# EAGLE design TRHCO2_datalogger (EAGLE 8.2.1)
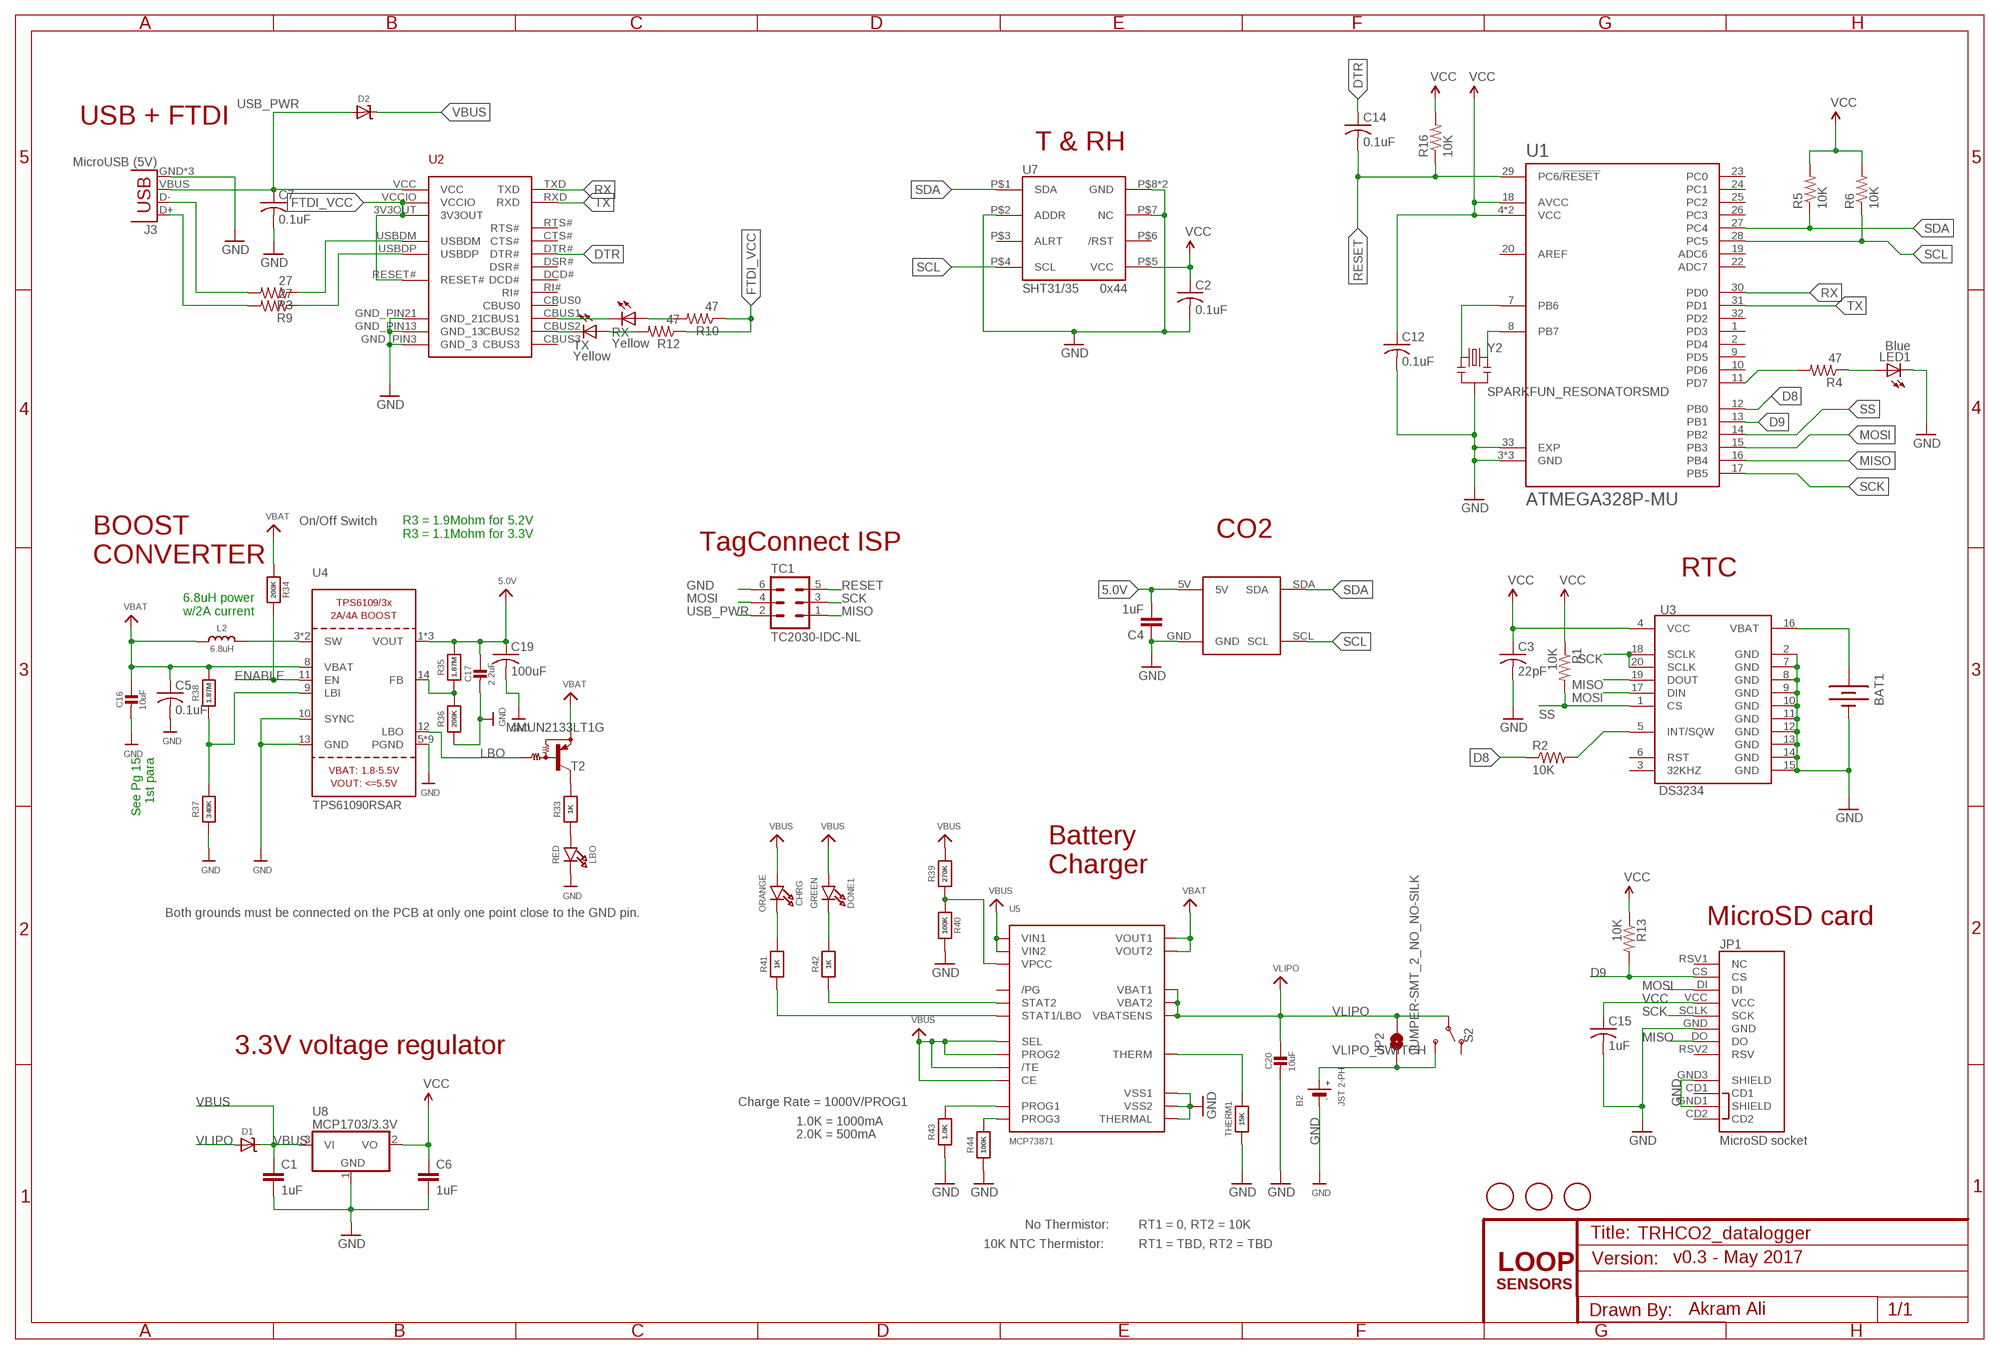
[diagram p0: schematic, sheet 1]

## Parts
B2  JST 2-PH  BATTERY  [JSTPH2]
BAT1  BATTERY12MM  [BATTCON_12MM]
C1  1uF  CAP0805  [0805]
C2  0.1uF  C-USC0402  [C0402]
C3  22pF  C-USC0402  [C0402]
C4  1uF  CAP0805  [0805]
C5  0.1uF  C-USC0402  [C0402]
C6  1uF  CAP0805  [0805]
C7  0.1uF  C-USC0402  [C0402]
C12  0.1uF  C-USC0402  [C0402]
C14  0.1uF  C-USC0402  [C0402]
C15  1uF  C-USC0402  [C0402]
C16  10uF  CAP_CERAMIC0805-NOOUTLINE  [0805-NO]
C17  2.2uF  CAP_CERAMIC0805-NOOUTLINE  [0805-NO]
C19  100uF  C-USC1210  [C1210]
C20  10uF  CAP_CERAMIC0805-NOOUTLINE  [0805-NO]
CHRG  ORANGE  LED0805_NOOUTLINE  [CHIPLED_0805_NOOUTLINE]
D1  MICROBUILDER_DIODE-SCHOTTKYSOD-123  [MICROBUILDER_SOD-123]
D2  MICROBUILDER_DIODE-SCHOTTKYSOD-123  [MICROBUILDER_SOD-123]
DONE1  GREEN  LED0805_NOOUTLINE  [CHIPLED_0805_NOOUTLINE]
J3  MicroUSB (5V)  USB-MICROB  [USB-MICROB]
JP1  MicroSD socket  USD-SOCKETNEW  [MICRO-SD-SOCKET-PP]
JP2  JUMPER-SMT_2_NO_NO-SILK  [SMT-JUMPER_2_NO_NO-SILK]
L2  6.8uH  INDUCTORTDK_VLC5045  [INDUCTOR_5X5MM_TDK_VLC5045]
LBO  RED  LED0805_NOOUTLINE  [CHIPLED_0805_NOOUTLINE]
LED1  Blue  LEDCHIPLED_0805  [CHIPLED_0805]
R1  10K  R-US_R0402  [R0402]
R2  10K  R-US_R0402  [R0402]
R3  27  R-US_R0402  [R0402]
R4  47  R-US_R0402  [R0402]
R5  10K  R-US_R0402  [R0402]
R6  10K  R-US_R0402  [R0402]
R9  27  R-US_R0402  [R0402]
R10  47  R-US_R0402  [R0402]
R12  47  R-US_R0402  [R0402]
R13  10K  R-US_R0402  [R0402]
R16  10K  R-US_R0402  [R0402]
R33  1K  RESISTOR0805_NOOUTLINE  [0805-NO]
R34  200K  RESISTOR0805_NOOUTLINE  [0805-NO]
R35  1.87M  RESISTOR0805_NOOUTLINE  [0805-NO]
R36  200K  RESISTOR0805_NOOUTLINE  [0805-NO]
R37  340K  RESISTOR_0805MP  [_0805MP]
R38  1.87M  RESISTOR_0805MP  [_0805MP]
R39  270K  RESISTOR0805_NOOUTLINE  [0805-NO]
R40  100K  RESISTOR0805_NOOUTLINE  [0805-NO]
R41  1K  RESISTOR0805_NOOUTLINE  [0805-NO]
R42  1K  RESISTOR0805_NOOUTLINE  [0805-NO]
R43  1.0K  RESISTOR0805_NOOUTLINE  [0805-NO]
R44  100K  RESISTOR0805_NOOUTLINE  [0805-NO]
RX  Yellow  LEDCHIPLED_0805  [CHIPLED_0805]
S2  SWITCH-SPDT-SMD-RIGHT-ANGLE  [SWITCH_SPST_SMD_A]
T2  MMUN2133LT1G  MUN2114T1-PNP_DRIVER-SC59-BEC  [SC59-BEC]
TC1  TC2030-IDC-NL  [TC2030-IDC-NL]
THERM1  15K  RESISTOR0805_NOOUTLINE  [0805-NO]
TX  Yellow  LEDCHIPLED_0805  [CHIPLED_0805]
U1  ATMEGA328P-MU  [QFN50P500X500X100-33N]
U2  FT231XQ-R  [FTDI_FT231XQ-R_PACKAGE]
U3  DS3234  [DS3234]
U4  TPS61090RSAR  VREG_TPS6103X  [PVQFN-16]
U5  MCP73871  [QFN20_4MM]
U6  K30-CO2-I2C  [K30-CO2-I2C]
U7  SHT31/35  SHT31-DIS  [SHT3X]
U8  MCP1703/3.3V  MCP1703CB  [SOT23]
U$1  FIDUCIAL  [FIDUCIAL_1MM]
U$2  FIDUCIAL  [FIDUCIAL_1MM]
U$3  FIDUCIAL  [FIDUCIAL_1MM]
Y2  SPARKFUN_RESONATORSMD  [SPARKFUN_RESONATOR-SMD]

## Nets
5.0V: C4.2 C17.1 C19.1 R35.2 U4.1(VOUT) U4.15(VOUT) U4.16(VOUT) U6.5V
D8: R2.1 U1.12(PB0)
D9: JP1.CS R13.2 U1.13(PB1)
DTR: C14.1 U2.DTR#
ENABLE: R34.2 U4.11(EN)
FTDI_VCC: R10.1 R12.1 U2.3V3OUT U2.RESET# U2.VCCIO
GND: B2.1(-) BAT1.GND(-) C1.2 C2.2 C3.2 C4.1 C5.2 C6.2 C7.2 C12.2 C15.2 C16.2 C17.2 C19.2 C20.2 J3.GND J3.MT1(GND) J3.MT2(GND) JP1.GND JP1.GND1(SHIELD) JP1.GND3(SHIELD) LBO.C LED1.C R36.1 R37.1 R40.2 R43.1 R44.1 TC1.6 THERM1.1 U1.3(GND) U1.5(GND) U1.21(GND) U1.33(EXP) U2.GND_PIN3(GND_3) U2.GND_PIN13(GND_13) U2.GND_PIN21(GND_21) U3.2(GND) U3.7(GND) U3.8(GND) U3.9(GND) U3.10(GND) U3.11(GND) U3.12(GND) U3.13(GND) U3.14(GND) U3.15(GND) U4.5(PGND) U4.6(PGND) U4.7(PGND) U4.10(SYNC) U4.13(GND) U4.P$18(PGND) U4.P$19(PGND) U4.P$20(PGND) U4.P$21(PGND) U4.P$22(PGND) U4.THERMAL(PGND) U5.P$10(VSS1) U5.P$11(VSS2) U5.P$21(THERMAL) U6.GND U7.P$2(ADDR) U7.P$7(NC) U7.P$8(GND) U7.PAD(GND) U8.1(GND) Y2.2
LBO: T2.B U4.12(LBO)
MISO: JP1.DO TC1.1 U1.16(PB4) U3.19(DOUT)
MOSI: JP1.DI TC1.4 U1.15(PB3) U3.17(DIN)
N$1: R4.2 U1.11(PD7)
N$2: R2.2 U3.5(INT/SQW)
N$3: LED1.A R4.1
N$4: U1.8(PB7) Y2.3
N$5: U1.7(PB6) Y2.1
N$6: L2.P$2 U4.3(SW) U4.4(SW)
N$7: R37.2 R38.1 U4.9(LBI)
N$8: BAT1.PWR@1(+) U3.16(VBAT)
N$14: LBO.A R33.1
N$17: RX.C U2.CBUS1
N$18: TX.C U2.CBUS2
N$25: R3.1 U2.USBDM
N$26: R9.1 U2.USBDP
N$27: R10.2 RX.A
N$28: R35.1 R36.2 U4.14(FB)
N$29: R12.2 TX.A
N$30: R33.2 T2.C
N$31: R39.1 R40.1 U5.P$2(VPCC)
N$32: J3.D- R3.2
N$33: J3.D+ R9.2
N$34: R42.1 U5.P$7(STAT2)
N$35: R41.1 U5.P$8(STAT1/LBO)
N$36: R43.2 U5.P$13(PROG1)
N$37: THERM1.2 U5.P$5(THERM)
N$38: DONE1.C R42.2
N$39: CHRG.C R41.2
N$40: R44.2 U5.P$12(PROG3)
RESET: C14.2 R16.1 TC1.5 U1.29(PC6/!RESET)
RX: U1.30(PD0) U2.TXD
SCK: JP1.SCLK(SCK) TC1.3 U1.17(PB5) U3.18(SCLK) U3.20(SCLK)
SCL: R6.1 U1.28(PC5) U6.SCL U7.P$4(SCL)
SDA: R5.1 U1.27(PC4) U6.SDA U7.P$1(SDA)
SS: R1.2 U1.14(PB2) U3.1(CS)
TX: U1.31(PD1) U2.RXD
USB_PWR: C7.1 D2.A J3.VBUS TC1.2 U2.VCC
VBAT: C5.1 C16.1 L2.P$1 R34.1 R38.2 T2.E U4.8(VBAT) U5.P$1(VOUT1) U5.P$20(VOUT2)
VBUS: C1.1 CHRG.A D1.C D2.C DONE1.A R39.2 U5.P$3(SEL) U5.P$4(PROG2) U5.P$9(/TE) U5.P$17(CE) U5.P$18(VIN1) U5.P$19(VIN2) U8.3(VI)
VCC: C2.1 C3.1 C6.1 C12.1 C15.1 JP1.VCC R1.1 R5.2 R6.2 R13.1 R16.2 U1.4(VCC) U1.6(VCC) U1.18(AVCC) U3.4(VCC) U7.P$5(VCC) U8.2(VO)
VLIPO: C20.1 D1.A JP2.2 S2.2(P) U5.P$14(VBAT1) U5.P$15(VBAT2) U5.P$16(VBATSENS)
VLIPO_SWITCH: B2.2(+) JP2.1 S2.3(S)
Unconnected: JP1.CD1 JP1.CD2 JP1.RSV1(NC) JP1.RSV2(RSV) S2.1(O) U1.1(PD3) U1.2(PD4) U1.9(PD5) U1.10(PD6) U1.19(ADC6) U1.20(AREF) U1.22(ADC7) U1.23(PC0) U1.24(PC1) U1.25(PC2) U1.26(PC3) U1.32(PD2) U2.CBUS0 U2.CBUS3 U2.CTS# U2.DCD# U2.DSR# U2.RI# U2.RTS# U3.3(32KHZ) U3.6(RST) U5.P$6(/PG) U7.P$3(ALRT) U7.P$6(/RST)

## Notes on the sheet
- USB + FTDI
- T & RH
- 0x44
- On/Off Switch
- R3 = 1.9Mohm for 5.2V
  R3 = 1.1Mohm for 3.3V
- CO2
- TagConnect ISP
- BOOST
  CONVERTER
- RTC
- 6.8uH power
  w/2A current
- See Pg 15
  1st para
- Battery
  Charger
- Both grounds must be connected on the PCB at only one point close to the GND pin.
- MicroSD card
- 3.3V voltage regulator
- Charge Rate = 1000V/PROG1
- 1.0K = 1000mA
- 2.0K = 500mA
- No Thermistor: | RT1 = 0, RT2 = 10K
- 10K NTC Thermistor: | RT1 = TBD, RT2 = TBD
- v0.3 - May 2017
- LOOP
- SENSORS
- Akram Ali

## Library data of the parts
B2 = microbuilder:BATTERY: CR1220 SMT - Digikey: 3001K-ND CD2032 BAT-HLD-001 - Digikey: BAT-HLD-001-ND
BAT1 = SparkFun-Electromechanical:BATTERY: Battery Holders Various common sizes : AA, AAA, 18650 (PRT-12895), 20mm coin cell and 12mm coin cell. 20MM_4LEGS, BATT-10373; MPN: 3000; PROD_ID: BATT-08044
C1 C4 C6 = SparkFun-Capacitors:CAP: Capacitor Standard 0603 ceramic capacitor, and 0.1" leaded capacitor.; MPN: CC0805KKX7R7BB105
C2 C3 C5 C7 C12 C14 C15 = adafruit:C-US: CAPACITOR, American symbol
C16 C17 C20 = microbuilder:CAP_CERAMIC: Ceramic Capacitors For new designs, use the packages preceded by an '_' character since they are more reliable: The following footprints should be used on most boards: _0402 - Standard footprint for regular board layouts _0603 - Standard footprint for regular board layouts _0805 - Standard footprint for regular board layouts _1206 - Standard footprint for regular board layouts For extremely tight-pitch boards where space is at a premium, the following 'micro-pitch' footprints can be used (smaller pads, no silkscreen outline, etc.): _0402MP - Micro-pitch footprint for very dense/compact boards _0603MP - Micro-pitch footprint for very dense/compact boards _0805MP - Micro-pitch footprint for very dense/compact boards _1206MP - Micro-pitch footprint for very dense/compact boards
C19 = rcl:C-US: CAPACITOR, American symbol
CHRG DONE1 LBO = microbuilder:LED: LED
D1 D2 = Adafruit Feather 32u4 Bluefruit LE:MICROBUILDER_DIODE-SCHOTTKY
J3 = SparkFun-Connectors:USB: USB Connectors USB-B-PTH is fully proven SKU : PRT-00139/CONN-08278 USB-miniB is fully proven SKU : PRT-00587 USB-A-PCB is untested. USB-A-H is throughly reviewed, but untested. Spark Fun Electronics SKU : PRT-00437 USB-B-SMT is throughly reviewed, but untested. Needs silkscreen touching up. USB-A-S has not been used/tested USB-MB-H has not been used/tested USB-MICROB has been used. CONN-09505; MPN: CONN-09505; PROD_ID: CONN-09505
JP1 = SparkFun-Connectors:USD-SOCKET: microSD Socket Push-push type uSD socket. Schematic element and footprint production proven. Spark Fun Electronics SKU : PRT-00127. tDoc lines correctly indicate media card edge positions when inserting (unlocked, locked, depressed). NOTE: CD1 and CD2 are connected internally; PROD_ID: CONN-07820
JP2 = SparkFun-Jumpers:JUMPER-SMT_2_NO: Normally open jumper This jumper has two pads in close proximity to each other. Apply solder to close the connection. Round pads are easier to solder for beginners, but are a lot larger. SparkFun Product that uses the round pads: SparkFun EL Sequencer <https://www.sparkfun.com/products/12781>
L2 = microbuilder:INDUCTOR: Inductors 0603: 10nH Ceramic Inductor - microwire antenna/RF (Digikey: 712-1434-2-ND) 0805: 560nH Ceramic Inductor - RF (Digikey: 553-1047-1-ND) 270nH Ceramic Inductor - Q = 40@250MHz, +-5%, 1 Ohm DC Resistance (Digikey: 535-10506-2-ND) 1007 (2518 Metric) SMT: 10µH 10% 250mOhm 820mA 1007 Inductor (Digikey: 587-2189-1-ND) 22µH 10% 500mOhm 580mA 1007 Inductor (Digikey: 587-2190-1-ND) 47µH 10% 950mOhm 420mA 1007 Inductor (Digikey: 587-2191-1-ND) 47µH 5% 100mOhm 1A 1008 Inductor (Digikey: 732-1816-1-ND) 5.0x5.0mm (Taiyo Yuden NR5040 Series) 6.8µH 20% 2.3A 64mOhm Inductor (Digikey: 587-2374-2-ND) 5.0x5.0mm (TDK VLC5045 Series) 4.7µH 20% 3.3A 34mOhm Inductor (Digikey: 445-6526-1-ND) 6.8µH 20% 2.7A 46mOhm Inductor (Digikey: 445-6527-1-ND) 6.0x6.0mm (TDK VLC6045 Series) 4.7µH 20% 3.8A 27mOhm Inductor (Digikey: 445-6538-2-ND) 6.8µH 20% 3A 41mOhm Inductor (Digikey: 445-6540-1-ND) 6.2µH 30% 2.2A 45mOhm Inductor (Digikey: SRR5028-6R2YCT-ND) - Not TDK VLC6045 but footprint should match 6.0x6.0mm (TDK SLF6045 Series) 6.8uH 30% 2A 33mOhm Inductor (Digikey: 445-4572-1-ND, Mouser: 810-SLF645T6R8N2R0PF) 6.0x6.0mm (Sumida CDRH5D28 Series) 6.2uH 30% 1.8A 45mOhm Inductor (Digikey: 308-1542-1-ND) Taiyo Yuden NR3015T2R2M - 2.2uH 20% 1.5A (Digikey: 587-1648-2-ND, Mouser: 963-NR3015T2R2M) - Used with TI TPS62172 CoilCraft RFID Transponder Coil - MA5532-AE (For use with AS3935 Lightning Sensor) Vishay IHLP 1.0uH Molded Inductor - 24mOhm DCR, 5A, +/-20%, -55°C-125°C (Digikey: 541-1319-1-ND)
LED1 = adafruit:LED: LED; MPN: 150080BS75000
R1-R6 R9 R10 R12 R13 R16 = adafruit:R-US_: RESISTOR, American symbol
R33-R44 THERM1 = microbuilder:RESISTOR: Resistors For new designs, use the packages preceded by an '_' character since they are more reliable: The following footprints should be used on most boards: _0402 - Standard footprint for regular board layouts _0603 - Standard footprint for regular board layouts _0805 - Standard footprint for regular board layouts _1206 - Standard footprint for regular board layouts For extremely tight-pitch boards where space is at a premium, the following 'micro-pitch' footprints can be used (smaller pads, no silkscreen outline, etc.): _0402MP - Micro-pitch footprint for very dense/compact boards _0603MP - Micro-pitch footprint for very dense/compact boards _0805MP - Micro-pitch footprint for very dense/compact boards _1206MP - Micro-pitch footprint for very dense/compact boards
RX = adafruit:LED: LED; MPN: LG R971-KN-1
S2 = SparkFun-Switches:SWITCH-SPDT: Single Pole, Double Throw (SPDT) Switch Single-pole, double-throw (SPDT) switch. Variant Overview SMD-AYZ0202 Surface Mount DPDT Switch <https://www.sparkfun.com/products/597> (COM-00597) Used on e.g. LilyPad Arduino USB - ATmega32U4 Board <https://www.sparkfun.com/products/12049> PTH-11.6X4.0MM SPDT Mini Power Switch <https://www.sparkfun.com/products/102> (COM-00102) Used on e.g. SparkFun Simon Says - Through-Hole Soldering Kit <https://www.sparkfun.com/products/10547> (KIT-10547) PTH-11.6X4.0MM-KIT KIT version of SPDT Mini Power Switch - Simplifies soldering by removing tStop of switch pins - only one side can be soldered. PTH-11.6X4.0MM-LOCK LOCK version of SPDT Mini Power Switch - Offset pins hold switch in place for easier soldering. SMD-RIGHT-ANGLE Surface Mount Right Angle Switch <https://www.sparkfun.com/products/10860> (COM-10860) Used on e.g. SparkFun ESP8266 Thing <https://www.sparkfun.com/products/13231>; PROD_ID: SWCH-10651; SF_SKU: COM-10860
T2 = transistor:*-PNP_DRIVER-: PNP Bias Resistor Transistor
TC1 = TagConnect:TC2030-IDC: Tag-Connect In Circuit Programming & Debug Cable 6 Pin http://www.tag-connect.com
TX = adafruit:LED: LED; MPN: LH R974-LP-1
U1 = ATMEGA328P-MU:ATMEGA328P-MU: ATmega Series 20 MHz 32 KB Flash 2 KB SRAM 8-Bit Microcontroller - QFN-32; AVAILABILITY: Good; DESCRIPTION: ATmega Series 20 MHz 32 KB Flash 2 KB SRAM 8-Bit Microcontroller - QFN-32; MF: Atmel; MP: ATMEGA328P-MU; PACKAGE: QFN-32 Atmel; PRICE: 2.55 USD
U2 = ftdi_ft231xq-r:FT231XQ-R: This is the 20-LD QFN package of the FTDI FT231XQ-R chip.; MPN: FT231XQ-R
U3 = SparkFun-FreqCtrl:DS3234: SPI RTC module with battery backup and internal clock.; MPN: DS3234S#
U4 = microbuilder:VREG_TPS6103X: TPS6103x 4A Boost - 1.8-5.5V Input, Adjustable Output to 5.5V
U5 = microbuilder:MCP73871: MCP73871 Lithium Polymer Battery Charger Digikey: MCP73871-2CCI/ML-ND
U6 = K30-CO2-I2C:K30-CO2-I2C: K-30 CO2 sensor I2C connection Designed by AKstudios
U7 = thomasb9511:SHT31-DIS; MPN: SHT31-DIS-B
U8 = linear:MCP1703: 250 mA, 16V, Low Quiescent Current LDO Regulator Source: http://ww1.microchip.com/downloads/en/DeviceDoc/22049b.pdf; MPN: MCP1703T-2502E/CB
U$1-U$3 = adafruit:FIDUCIAL: For use by pick and place machines to calibrate the vision/machine, 1mm By microbuilder.eu
Y2 = Adafruit Feather 32u4 Bluefruit LE:SPARKFUN_RESONATOR: Resonator Small SMD resonator. This is the itty bitty 10/20MHz resonators with built in caps. CSTCE10M0G55 and CSTCE20M0V53. Footprint has been reviewed closely but hasn't been tested yet.

## Board
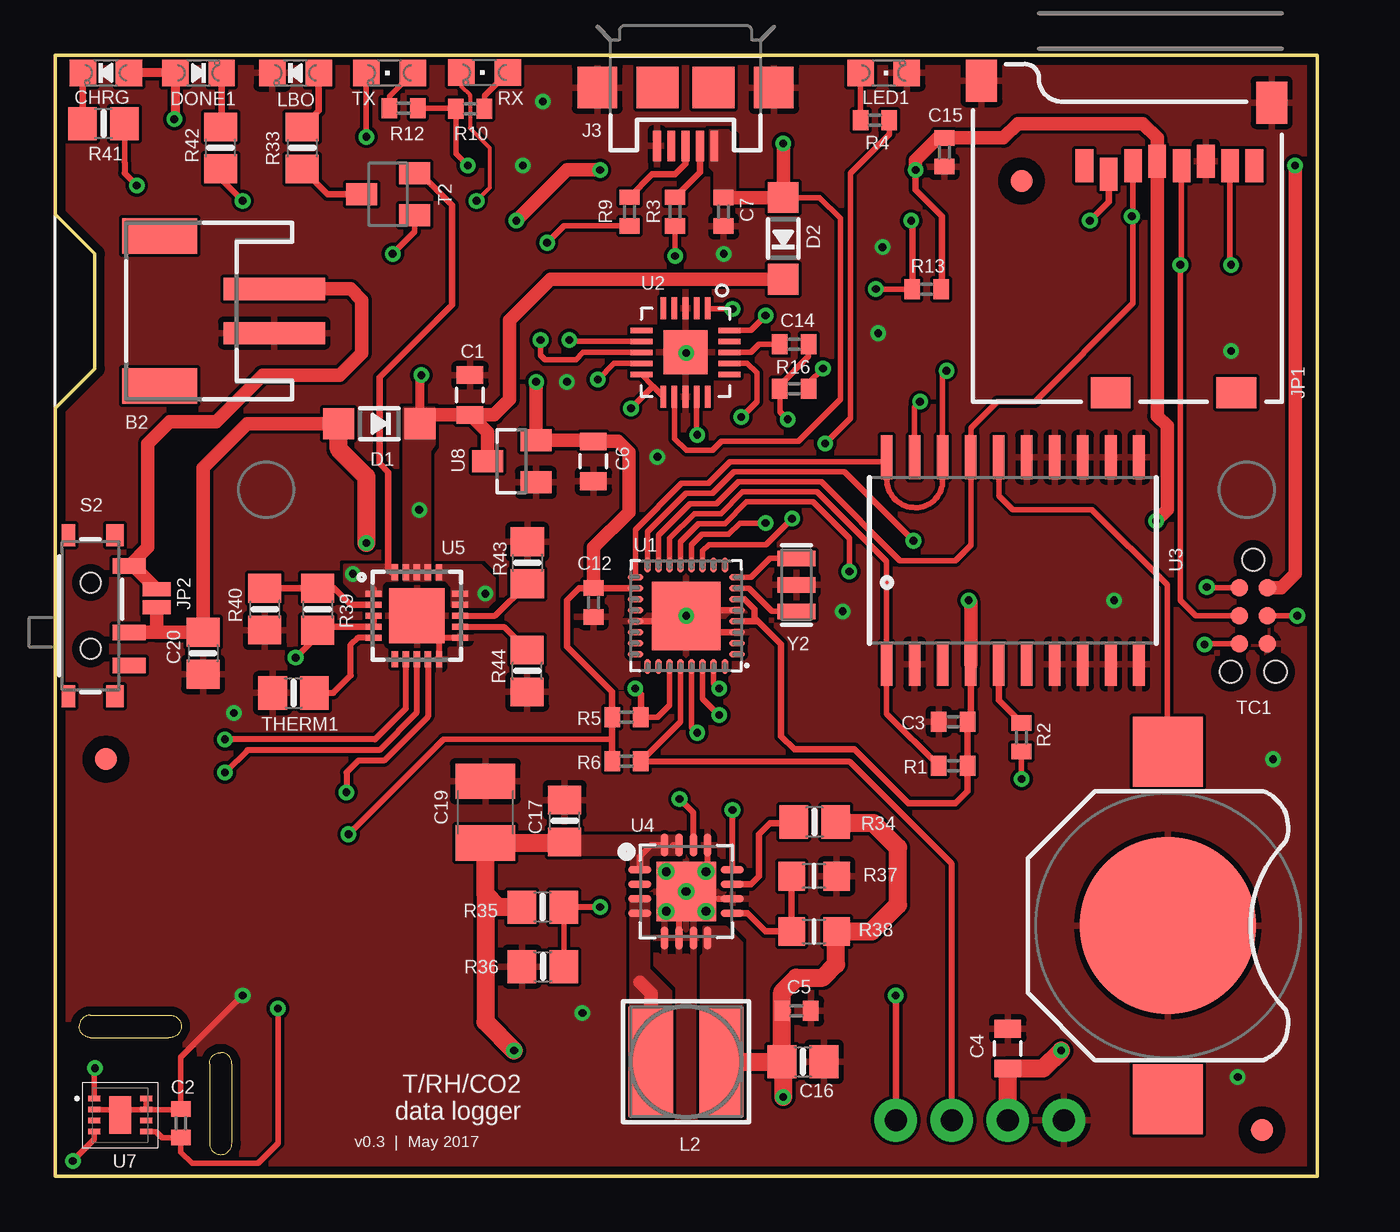
[diagram p1: board, top side]
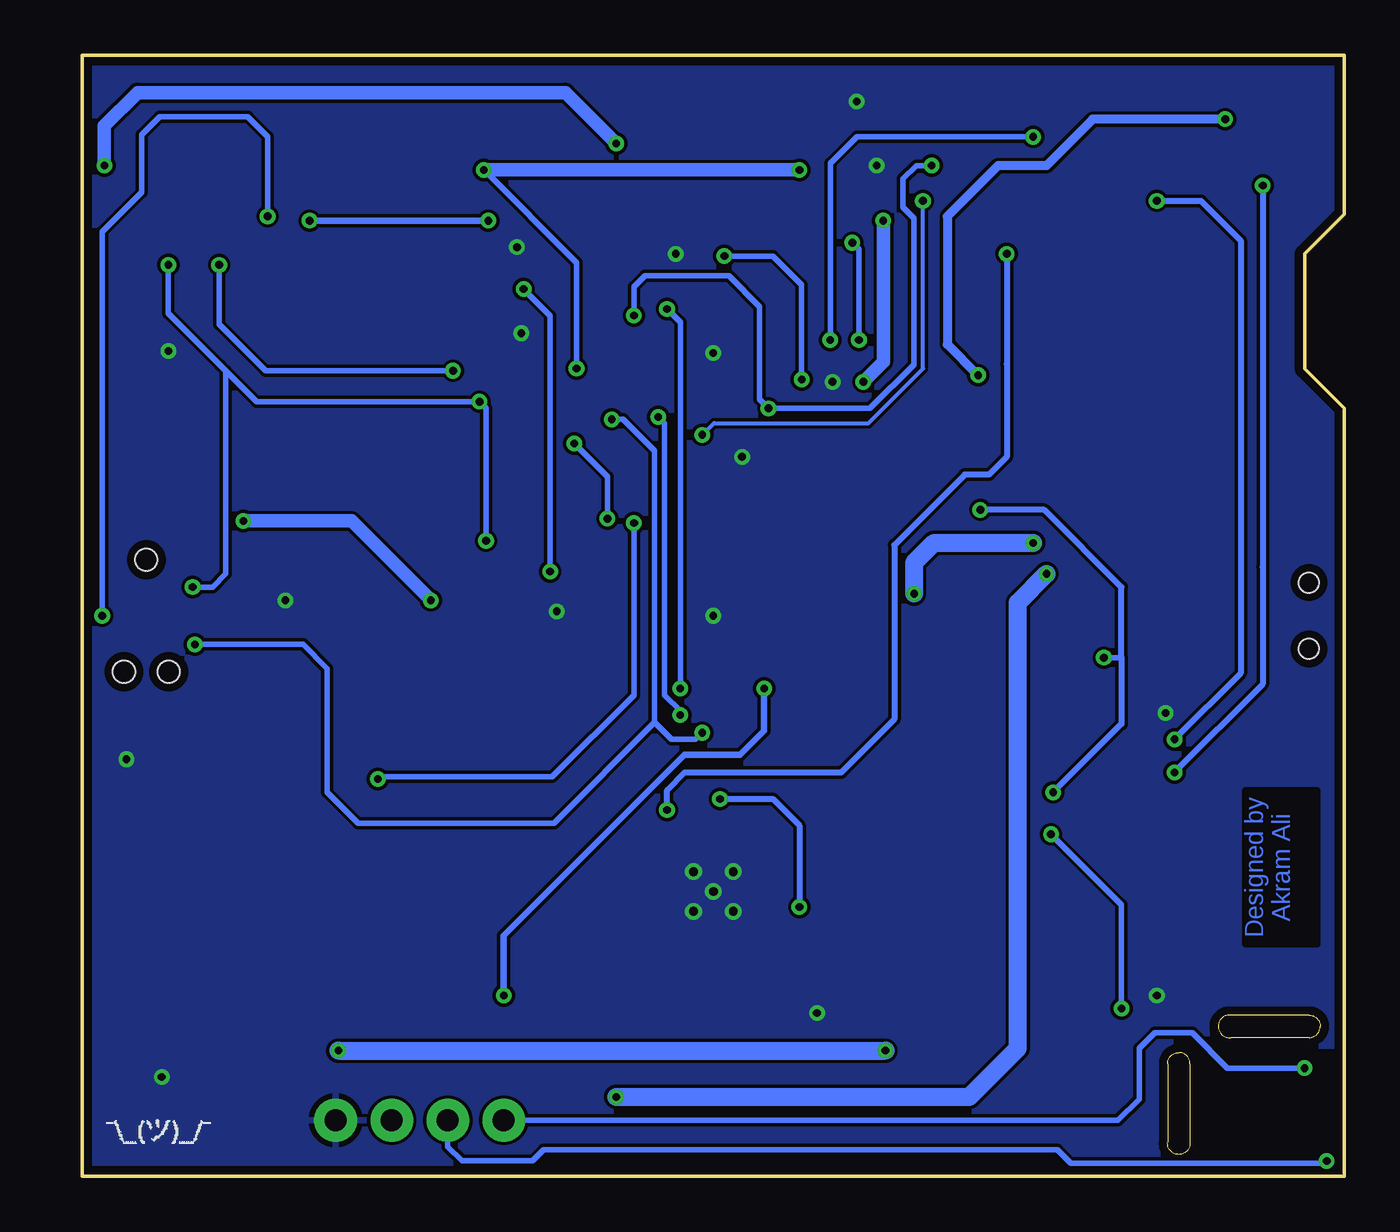
[diagram p2: board, bottom side, seen from below]

Size 57.2 x 50.8 mm. Coordinates in mm from the lower left corner, seen from the top.
Outline: 1.6,6.29 arc-90 1.09,6.8 arc-90 1.6,7.3 5.21,7.3 arc-90 5.71,6.8 arc-95 5.16,6.29 1.6,6.29
Outline: 8.01,5.1 arc90 7.5,5.61 arc90 7,5.1 7,1.5 arc90 7.5,0.99 arc95 8.01,1.55 8.01,5.1
Outline: 0,50.8 0,43.6 1.8,41.8 1.8,36.6 0,34.8 0,0 57.2,0 57.2,50.8 0,50.8
Copper layers (1*16): Top 0.0356mm / dielectric 1.5011mm / Bottom 0.0356mm
Design rules "oshpark-2layer": minimum track width 6mil, minimum drill 13mil, track to track 6mil, track to pad 6mil, pad to pad 6mil, via to via 6mil, smd to smd 6mil, copper to edge 15mil, drill to drill 6mil, minimum pad ring 7mil, minimum via ring 7mil, stop-mask expansion 2.5mil, vias tented up to drill 0mil, thermal gap 10mil

### Footprints (pad centres in the part's own frame; a part is rotated, then mirrored left to right if it is on the bottom)
JSTPH2 = smd 1 x 4.6: 1 -1,-3.7; 2 1,-3.7 | smd 1.6 x 3.4: NC1 -3.4,1.5; NC2 3.4,1.5
BATTCON_12MM = smd 8 x 8: GND 0,0 | smd 3.175 x 3.175: PWR@1 -7.874,0; PWR@2 7.874,0
0805 = smd 0.8 x 1.2: 1 -0.9,0; 2 0.9,0
C0402 = smd 0.7 x 0.9: 1 -0.65,0; 2 0.65,0
0805-NO = smd 1.3 x 1.5: 1 -0.95,0; 2 0.95,0
C1210 = smd 1.6 x 2.7: 1 -1.4,0; 2 1.4,0
CHIPLED_0805_NOOUTLINE = smd 1.2 x 1.2: A 0,-1.05; C 0,1.05
MICROBUILDER_SOD-123 = smd 1.4 x 1.4: A 1.85,0; C -1.85,0
USB-MICROB = smd 0.35 x 1.4: D+ 0,2.65; D- -0.65,2.65; GND 1.3,2.65; ID 0.65,2.65; VBUS -1.3,2.65 | smd 1.8 x 1.9: MT1 -4,0; MT2 4,0 | smd 1.9 x 1.9: P$1 -1.27,0; P$2 1.27,0
MICRO-SD-SOCKET-PP = smd 1.8 x 1.4: CD1 -2.05,0.4; CD2 -7.75,0.4 | smd 0.8 x 1.5: CS -7.84,10.3; DI -6.74,10.7; DO -2.34,10.7; GND -3.44,10.9; RSV1 -8.94,10.7; RSV2 -1.24,10.7; SCLK -4.54,10.7; VCC -5.64,10.9 | smd 1.4 x 1.9: GND1 -13.6,14.55; GND3 -0.45,13.55
SMT-JUMPER_2_NO_NO-SILK = smd 0.635 x 1.27: 1 -0.406,0; 2 0.406,0
INDUCTOR_5X5MM_TDK_VLC5045 = smd 2 x 5: P$1 -1.6,0; P$2 1.6,0
CHIPLED_0805 = smd 1.2 x 1.2: A 0,-1.05; C 0,1.05
R0402 = smd 0.7 x 0.9: 1 -0.65,0; 2 0.65,0
_0805MP = smd 1.2 x 1.3: 1 -1.016,0; 2 1.016,0
SWITCH_SPST_SMD_A = smd 0.7 x 1.5: 1 -2.25,-1.75; 2 -0.75,-1.75; 3 2.25,-1.75 | smd 1 x 0.6: GND1 -3.65,1; GND3 3.65,1 | smd 1 x 0.8: GND2 -3.65,-1.1; GND4 3.65,-1.1 | hole 0.9: -1.5,0; 1.5,0
SC59-BEC = smd 1 x 1.4: B -0.95,-1.2; C 0,1.2; E 0.95,-1.2
TC2030-IDC-NL = smd 0.787 x 0.787: 1 -1.27,-0.635; 2 -1.27,0.635; 3 0,-0.635; 4 0,0.635; 5 1.27,-0.635; 6 1.27,0.635 | hole 0.991: -2.54,0; 2.54,1.016; 2.54,-1.016
QFN50P500X500X100-33N = smd 0.7 x 0.3: 1 -2.3,1.75; 2 -2.3,1.25; 3 -2.3,0.75; 4 -2.3,0.25; 5 -2.3,-0.25; 6 -2.3,-0.75; 7 -2.3,-1.25; 8 -2.3,-1.75; 17 2.3,-1.75; 18 2.3,-1.25; 19 2.3,-0.75; 20 2.3,-0.25; 21 2.3,0.25; 22 2.3,0.75; 23 2.3,1.25; 24 2.3,1.75 | smd 0.3 x 0.7: 9 -1.75,-2.3; 10 -1.25,-2.3; 11 -0.75,-2.3; 12 -0.25,-2.3; 13 0.25,-2.3; 14 0.75,-2.3; 15 1.25,-2.3; 16 1.75,-2.3; 25 1.75,2.3; 26 1.25,2.3; 27 0.75,2.3; 28 0.25,2.3; 29 -0.25,2.3; 30 -0.75,2.3; 31 -1.25,2.3; 32 -1.75,2.3 | smd 3.1 x 3.1: 33 0,0
FTDI_FT231XQ-R_PACKAGE = smd 0.25 x 1: 3V3OUT 0.968,-2.032; CBUS2 -0.532,-2.032; CBUS3 0.968,1.968; CTS# -1.032,-2.032; DTR# -0.032,1.968; RTS# -0.532,1.968; TXD 0.468,1.968; USBDM 0.468,-2.032; USBDP -0.032,-2.032; VCCIO -1.032,1.968 | smd 1 x 0.25: CBUS0 1.968,0.968; CBUS1 1.968,0.468; DCD# -2.032,-1.032; DSR# -2.032,-0.532; GND_PIN3 -2.032,-0.032; GND_PIN13 1.968,-0.032; RESET# 1.968,-1.032; RI# -2.032,0.468; RXD -2.032,0.968; VCC 1.968,-0.532 | smd 2 x 2: GND_PIN21 -0.032,-0.032
DS3234 = smd 0.53 x 1.98: 1 -5.715,-4.685; 2 -4.445,-4.685; 3 -3.175,-4.685; 4 -1.905,-4.685; 5 -0.635,-4.685; 6 0.635,-4.685; 7 1.905,-4.685; 8 3.175,-4.685; 9 4.445,-4.685; 10 5.715,-4.685; 11 5.715,4.685; 12 4.445,4.685; 13 3.175,4.685; 14 1.905,4.685; 15 0.635,4.685; 16 -0.635,4.685; 17 -1.905,4.685; 18 -3.175,4.685; 19 -4.445,4.685; 20 -5.715,4.685
PVQFN-16 = smd 1.05 x 0.35: 1 -2.1,0.975; 2 -2.1,0.325; 3 -2.1,-0.325; 4 -2.1,-0.975; 9 2.1,-0.975; 10 2.1,-0.325; 11 2.1,0.325; 12 2.1,0.975 | smd 0.35 x 1.05: 5 -0.975,-2.1; 6 -0.325,-2.1; 7 0.325,-2.1; 8 0.975,-2.1; 13 0.975,2.1; 14 0.325,2.1; 15 -0.325,2.1; 16 -0.975,2.1 | drill 0.4: P$18 0,0; P$19 -0.9,0.9; P$20 0.9,0.9; P$21 0.9,-0.9; P$22 -0.9,-0.9 | smd 2.7 x 2.7: THERMAL 0,0
QFN20_4MM = smd 0.73 x 0.28: P$1 -1.965,1; P$2 -1.965,0.5; P$3 -1.965,0; P$4 -1.965,-0.5; P$5 -1.965,-1; P$11 1.965,-1; P$12 1.965,-0.5; P$13 1.965,0; P$14 1.965,0.5; P$15 1.965,1 | smd 0.28 x 0.73: P$6 -1,-1.965; P$7 -0.5,-1.965; P$8 0,-1.965; P$9 0.5,-1.965; P$10 1,-1.965; P$16 1,1.965; P$17 0.5,1.965; P$18 0,1.965; P$19 -0.5,1.965; P$20 -1,1.965 | smd 2.5 x 2.5: P$21 0,0
K30-CO2-I2C = drill 1 pad 1.93: 5V 43.18,2.54; GND 45.72,2.54; SCL 40.64,2.54; SDA 38.1,2.54
SHT3X = smd 0.55 x 0.25: P$1 -1.175,0.75; P$2 -1.175,0.25; P$3 -1.175,-0.25; P$4 -1.175,-0.75; P$5 1.175,-0.75; P$6 1.175,-0.25; P$7 1.175,0.25; P$8 1.175,0.75 | smd 1 x 1.7: PAD 0,0
SOT23 = smd 1 x 1.4: 1 -0.95,-1.1; 2 0.95,-1.1; 3 0,1.1
FIDUCIAL_1MM = smd 1 x 1: 1 0,0
SPARKFUN_RESONATOR-SMD = smd 0.7 x 1.7: 1 -1.2,0; 2 0,0; 3 1.2,0

### Placement (x,y rotation side)
B2  6.23,39.21 90 top
BAT1  50.44,11.36 270 top
C1  18.8,35.4 90 top
C2  5.7,2.41 90 top
C3  40.7,20.6 180 top
C4  43.17,5.79 270 top
C5  33.6,7.5 0 top
C6  24.4,32.4 270 top
C7  30.3,43.7 270 top
C12  24.4,26 270 top
C14  33.5,37.7 0 top
C15  40.3,46.4 270 top
C16  33.9,5.19 0 top
C17  23.1,16.1 90 top
C19  19.5,16.5 90 top
C20  6.7,23.7 270 top
CHRG  2.3,50 90 top
D1  14.7,34.1 180 top
D2  33,42.5 90 top
DONE1  6.5,50 270 top
J3  28.58,49.34 180 top
JP1  55.59,35.1 0 top
JP2  4.6,26.2 270 top
L2  28.6,5.2 180 top
LBO  10.89,49.99 90 top
LED1  37.56,50 270 top
R1  40.7,18.6 180 top
R2  43.79,19.9 90 top
R3  28.1,43.71 90 top
R4  37.16,47.85 0 top
R5  25.9,20.8 180 top
R6  25.9,18.8 180 top
R9  26.03,43.71 90 top
R10  18.81,48.37 0 top
R12  15.8,48.4 180 top
R13  39.5,40.2 180 top
R16  33.5,35.69 0 top
R33  11.2,46.6 270 top
R34  34.42,16.06 180 top
R35  22.1,12.2 180 top
R36  22.11,9.5 0 top
R37  34.4,13.6 180 top
R38  34.4,11.1 0 top
R39  11.9,25.7 270 top
R40  9.5,25.7 270 top
R41  2.19,47.7 180 top
R42  7.5,46.6 90 top
R43  21.4,27.8 270 top
R44  21.4,22.9 90 top
RX  19.46,50.01 90 top
S2  1.6,25.4 90 top
T2  15.1,44.5 90 top
TC1  54.3,25.4 270 top
THERM1  10.8,21.9 0 top
TX  15.15,50 90 top
U1  28.6,25.4 180 top
U2  28.6,37.3 270 top
U3  43.4,27.9 0 top
U4  28.6,12.91 0 top
U5  16.4,25.4 0 top
U6  0,0 0 top
U7  2.95,2.77 0 top
U8  20.69,32.4 90 top
U$1  2.3,18.9 0 top
U$2  43.8,45.1 0 top
U$3  54.7,2.1 0 top
Y2  33.6,26.8 90 top

### Tracks (layer width: path | path; a pad name or v marks a point on that pad's centre or on a via)
5.0V  (via drill 0.35 pad 0.13)
  Top 0.305: 28,15.01 U4.15 | U4.1 26.5,14.5 27,15 U4.16
  Top 0.61: 23.05,15.11 C17.1 23.24,15.01 | C19.1 | C4.2
  Top 0.813: C19.1 23.05,15.11 | R35.2 20.1,12.2 19.5,12.8 | 19.5,12.8 C19.1 | U6.5V C4.2 | C4.2 44.79,4.89 v45.6,5.7 | 19.5,12.8 19.5,7 v20.8,5.7
  Bottom 0.813: v45.6,5.7 v20.8,5.7
  pour Top (no thermals): 26.9,13.8 26.9,14.4 27.1,14.6 28.4,14.6 28.4,15.4 22.9,15.4 22.9,14.6 25.9,14.6 26.1,14.4 26.1,13.8
D8  (via drill 0.35)
  Top 0.254: U1.12 28.85,28.62 29.32,29.08 30.52,29.08 31.04,29.6 v32.2,29.6 | R2.1 v43.79,18.01 v43.8,18
  Bottom 0.254: v32.2,29.6 32.2,21.8 35.9,18.1 43.7,18.1 v43.8,18
D9  (via drill 0.35, 0.35 pad 0.13)
  Top 0.254: U1.13 28.35,28.76 29.16,29.57 30.36,29.57 31.34,30.56 34.35,30.56 36,28.9 v36,27.4 | v37.2,40.2 R13.2
  Top 0.305: JP1.CS 47.75,44.15 v46.9,43.3 | R13.2 38.85,43.25 v38.8,43.3
  Bottom 0.254: v36,27.4 36,39 v37.2,40.2
  Bottom 0.305: v46.9,43.3 v38.8,43.3
DTR
  Top 0.178: C14.1
  Top 0.254: U2.DTR# 31.53,37.33 31.9,37.7 C14.1
ENABLE
  Top 0.305: U4.11 31.53,13.23 31.9,13.6 31.9,15.5 32.4,16 33.42,16 R34.2
FTDI_VCC  (via drill 0.35 pad 0.13)
  Top 0.254: U2.3V3OUT 27.1,35.8 | 27.1,35.8 U2.RESET# | U2.VCCIO 31.53,38.33 v32.2,39 | R12.1 18.13,48.4 R10.1 18.16,46.34 v18.7,45.8 | 27.1,35.8 v26.1,34.8
  Bottom 0.254: v32.2,39 32.2,40.3 31.7,40.8 27.9,40.8 26.5,39.4 26.5,35.2 v26.1,34.8 21.49,34.8 19.52,36.77 19.52,43.42 20,43.9 20,45.2 19.4,45.8 v18.7,45.8
GND  (via drill 0.35 pad 0.13)
  Top 0.254: U5.P$11 17.4,24.4 | U5.P$10 17.4,24.4 | 17.4,24.4 U5.P$21 | U7.P$2 2.7,3.02 U7.PAD 3.2,3.02 U7.P$7 | U7.P$8 U7.P$7 | U7.P$7 5.67,3.02 C2.2 5.7,5.4 v8.5,8.2 | U4.13 29.57,13.88 U4.P$20 | U4.6 28.27,12.58 U4.P$18 28.92,12.58 30.07,12.58
  Top 0.305: U1.21 28.35,25.15 U1.33 | U4.10 30.07,12.58 | U1.3 29.35,24.65 U1.33 | U1.5 28.85,25.65 U1.33
  other vias: 28.6,37.3 30.3,41.8 8.1,21 23.9,7.4 53.6,4.5 28.6,25.4 22.1,48.7 37.3,38.2 53.3,37.4 48,26.1 55.2,18.9 35.7,25.6 37.5,42.1 23.2,36 27.3,32.6 21.2,45.8
  pour Bottom (rank 6): -0.1,5.89 6.59,5.99 6.79,-0.22 57.29,-0.07 57.29,50.93 -0.05,50.83
  pour Top (rank 6): -0.05,5.89 6.54,5.99 6.74,-0.17 57.34,-0.07 57.24,50.93 0.05,50.83
LBO  (via drill 0.35 pad 0.13)
  Top 0.254: T2.B 16.3,42.8 v15.3,41.8
  Top 0.279: U4.12 v30.7,16.6
  Bottom 0.279: v15.3,41.8 15.3,36.8 15.3,32.6 16.1,31.8 17.2,31.8 20.4,28.6 20.4,20.7 22.8,18.3 29.9,18.3 30.7,17.5 v30.7,16.6
MISO  (via drill 0.35, 0.35 pad 0.13)
  Top 0.254: JP1.DO 53.25,41.35 v53.3,41.3 | U3.19 38.96,34.86 v39.2,35.1 | U1.16 26.85,29.2 28.59,30.94 29.79,30.94 30.78,31.93 35.77,31.93 v38.9,28.8 | v52.2,26.7 52.23,26.67 TC1.1
  Bottom 0.254: v53.3,41.3 53.3,39.1 50.95,36.75 | 50.95,36.75 49.3,35.1 v39.2,35.1 38.9,34.8 v38.9,28.8 | v52.2,26.7 51.3,26.7 50.7,27.3 50.7,36.5 50.95,36.75
MOSI  (via drill 0.35 pad 0.13)
  Top 0.254: JP1.DI 48.85,43.55 | 48.85,43.55 48.85,39.55 44.4,35.1 42.7,35.1 41.5,33.9 U3.17 41.5,28.6 40.8,27.9 38.3,27.9 34.73,31.47 30.97,31.47 29.98,30.49 28.78,30.49 27.35,29.06 U1.15 | 48.85,43.55 v48.8,43.5 | TC1.4 v56.3,25.4
  Bottom 0.254: v48.8,43.5 48.8,47.1 49.7,48 53.7,48 54.5,47.2 54.5,44.6 56.3,42.8 v56.3,25.4
N$1  (via drill 0.35 pad 0.13)
  Top 0.254: U1.11 29.35,28.35 29.63,28.63 32.23,28.63 32.91,29.31 v33.4,29.8 | v34.9,33.2 36.06,34.36 36.06,45.46 37.81,47.21 R4.2
  Bottom 0.254: v33.4,29.8 33.4,31.7 v34.9,33.2
N$2
  Top 0.305: U3.5 42.77,21.57 R2.2
N$3
  Top 0.254: LED1.A R4.1
N$4
  Top 0.254: U1.8 31.55,27.15 32.4,28 Y2.3
N$5
  Top 0.254: U1.7 31.45,26.65 32.5,25.6 Y2.1
N$6
  Top 0.61: 26.5,8.8 27,8.3 L2.P$2
  pour Top (no thermals): 26.1,12.7 26.9,12.7 26.9,9.4 27.9,8.4 27.9,6.3 26.1,6.3
N$7
  Top 0.305: R37.2 R38.1 32.2,11.1 31.37,11.93 U4.9
N$8
  Top 0.254: U3.16 42.77,30.83 43.4,30.2 47,30.2 50.4,26.8 50.4,19.27 BAT1.PWR@1
N$14
  Top 0.305: LBO.A 11.94,48.29 R33.1
N$17  (via drill 0.35 pad 0.13)
  Top 0.178: RX.C 18.41,49.39 18.8,49 18.8,48.94 18.8,47.5 19.7,46.6 19.7,44.8 v19.1,44.2
  Top 0.254: U2.CBUS1 29.07,33.63 v29.1,33.6
  Bottom 0.178: v19.1,44.2 19.1,36.6 21.57,34.13 28.57,34.13 v29.1,33.6
N$18  (via drill 0.35 pad 0.13)
  Top 0.254: TX.C v14.1,47.1 | U2.CBUS2 23.37,37.83 v23.3,37.9
  Bottom 0.254: v14.1,47.1 22.1,47.1 23.3,45.9 v23.3,37.9
N$25  (via drill 0.35 pad 0.13)
  Top 0.254: v28.1,41.7 R3.1 | U2.USBDM 25.33,36.83 v24.6,36.1
  Bottom 0.254: v24.6,36.1 24.6,40.4 25.9,41.7 v28.1,41.7
N$26  (via drill 0.35 pad 0.13)
  Top 0.254: v22,37.9 22,37.2 22.2,37 23.6,37 23.93,37.33 U2.USBDP | R9.1 23.06,43.06 v22.3,42.3
  Bottom 0.254: v22,37.9 22,42 v22.3,42.3
N$27
  Top 0.254: R10.2 19.46,48.96 RX.A
N$28  (via drill 0.35 pad 0.13)
  Top 0.254: R36.2 R35.1
  Top 0.279: U4.14 28.92,16.48 v28.3,17.1 | v24.7,12.2 R35.1
  Bottom 0.279: v28.3,17.1 25.9,17.1 24.7,15.9 v24.7,12.2
N$29
  Top 0.254: R12.2 15.15,48.94 TX.A
N$30
  Top 0.305: T2.C 12.35,44.5 R33.2
N$31
  Top 0.305: U5.P$2 13.4,25.9 12.65,26.64 R39.1 R40.1
N$32
  Top 0.305: J3.D- 29.23,45.49 R3.2
N$33
  Top 0.305: J3.D+ 28.57,45.88 28.1,45.4 27.06,45.4 R9.2
N$34  (via drill 0.35 pad 0.13)
  Top 0.279: R42.1 7.5,45.2 v8.5,44.2 | U5.P$7 15.9,21.2 14.5,19.8 v7.7,19.8
  Bottom 0.279: v8.5,44.2 6.5,44.2 4.7,42.4 4.7,22.8 v7.7,19.8
N$35  (via drill 0.35 pad 0.13)
  Top 0.254: R41.1 3.15,45.95
  Top 0.279: 3.15,45.95 3.15,45.45 v3.7,44.9 | U5.P$8 16.38,23.42 16.38,21 14.7,19.32 8.72,19.32 v7.7,18.3
  Bottom 0.279: v3.7,44.9 3.7,27.6 3.7,22.3 v7.7,18.3
N$36
  Top 0.279: U5.P$13 19.95,25.4 R43.2
N$37
  Top 0.279: U5.P$5 13.7,24.4 13.4,24.1 13.4,22.7 12.6,21.9 THERM1.2
N$38
  Top 0.305: DONE1.C 7.55,47.6 R42.2
N$39
  Top 0.305: CHRG.C 1.25,47.7 R41.2
N$40
  Top 0.279: U5.P$12 20.35,24.9 R44.2
RESET  (via drill 0.35 pad 0.13)
  Top 0.254: U1.29 28.85,20.35 v29.1,20.1 | C14.2 34.15,37.15 32.85,35.85 R16.1 32.85,34.65 v33.2,34.3 | TC1.5 52.13,24.13 v52.1,24.1
  Bottom 0.254: v33.2,34.3 32.7,34.3 31.27,32.87 31.27,20.57 | v29.1,20.1 29.4,19.8 30.5,19.8 31.27,20.57 | v52.1,24.1 47.2,24.1 46.1,23 46.1,17.4 44.7,16 35.83,16 31.27,20.57
RX  (via drill 0.35 pad 0.13)
  Top 0.254: U2.TXD 31.37,36.83 31.8,36.4 31.8,35.1 v31.1,34.4 | U1.30 29.35,21.65 v30.1,20.9
  Bottom 0.254: v30.1,20.9 30.1,21.1 30.81,21.81 30.81,34.11 v31.1,34.4
SCK  (via drill 0.35)
  Top 0.254: v40.4,36.5 40.23,36.33 U3.18 40.23,31.53 arc-90 39,30.3 arc-90 37.69,31.61 U3.20 37.49,32.39 30.59,32.39 30.11,31.91 29.6,31.4 28.4,31.4 26.3,29.3 U1.17 | TC1.3 51.7,25.4 51,26.1 v51,41.3 51.05,41.35 JP1.SCLK
  Bottom 0.254: v51,41.3 51,38.6 48.9,36.5 v40.4,36.5
SCL  (via drill 0.35)
  Top 0.254: U1.28 28.35,20.6 R6.1 | U7.P$4 1.77,1.67 v0.8,0.7
  Top 0.279: R6.1 36,18.8 40.64,14.16 U6.SCL
  Bottom 0.254: U6.SCL 40.64,1.34 40,0.7 36.8,0.7 36.3,1.2 13,1.2 12.4,0.6 0.9,0.6 v0.8,0.7
SDA  (via drill 0.35 pad 0.13)
  Top 0.254: U1.27 27.85,21.35 27.3,20.8 R5.1 | U7.P$1 1.77,4.87 v1.8,4.9
  Top 0.305: R5.1 26.55,21.85 v26.3,22.1 | v38.1,8.2 U6.SDA
  Bottom 0.254: U6.SDA 10.26,2.54 9.3,3.5 9.3,5.8 8.6,6.5 6.9,6.5 5.3,4.9 v1.8,4.9
  Bottom 0.305: v26.3,22.1 26.3,20.2 27.4,19.1 29.9,19.1 38.1,10.9 v38.1,8.2 38.1,8.1
SS
  Top 0.254: R1.2 37.69,20.97 U3.1 37.69,27.87 34.54,31.01 31.16,31.01 30.17,30.03 28.97,30.03 27.85,28.91 U1.14
TX  (via drill 0.35 pad 0.13)
  Top 0.178: 29.6,39.3 U2.RXD
  Top 0.254: U1.31 29.85,22.35 v30.1,22.1 | v30.7,39.3 29.6,39.3
  Bottom 0.254: v30.1,22.1 30.1,32.4 30.1,38.7 v30.7,39.3
USB_PWR  (via drill 0.35 pad 0.13)
  Top 0.254: D2.A 34.65,44.35 35.6,43.4 35.6,35.2 33.7,33.3 30.2,33.3 29.79,32.89 28.61,32.89 28.07,33.43 U2.VCC
  Top 0.61: TC1.2 55.57,26.67 56.2,27.3 v56.2,45.8 | C7.1 D2.A v33,46.8
  Bottom 0.61: v56.2,45.8 56.2,47.6 54.7,49.1 35.3,49.1 v33,46.8
  pour Top (no thermals): 29.7,47.4 30.5,47.4 30.8,47.1 30.8,44.2 29.9,44.2 29.9,45.5 29.7,45.7
VBAT  (via drill 0.35 pad 0.13)
  Top 0.305: 14.43,26.6 U5.P$1 | U5.P$20 15.23,27.37 15.1,27.5 15.1,31.9 14.7,32.3 14.7,36.2 18,39.5 18,44 16.55,45.45 T2.E | 33,5.14 C16.1 | L2.P$1 30.4,5.2 29.75,5.85 | C5.1 | 35.4,11.08 R38.2 | 35.43,16 R34.1
  Top 0.406: 29.57,6.02 29.75,5.85
  Top 0.508: 30.2,5.39 30.4,5.2
  Top 0.61: 32.95,3.65 v33,3.6
  Top 0.813: 30.4,5.2 C16.1 | C16.1 C5.1 | C5.1 32.95,8.35 33.6,9 34.8,9 35.4,9.6 35.4,11.08 | R38.2 37,11.1 38.2,12.3 38.2,14.9 37.1,16 35.43,16 | v33,3.6 33,5.14
  Bottom 0.813: v33,3.6 17,3.6 14.8,5.8 14.8,26 v13.5,27.3
  pour Top (no thermals): 29.5,11.3 30.4,11.3 31.1,10.6 31.1,7.1 29.3,7.1 29.3,10 29.4,10.1 29.4,11.3
  pour Top (no thermals): 14.8,26.3 14.8,26.8 15,27 15.5,27 15.5,27.7 13.1,27.7 13.1,26.9 13.7,26.3
VBUS  (via drill 0.35 pad 0.13)
  Top 0.254: R39.2 11.9,24.5 v10.9,23.5
  Top 0.279: R39.2 11.74,24.75 | U5.P$9 16.9,20.83 14.9,18.84 13.73,18.84 13.2,18.3 v13.2,17.4
  Top 0.305: DONE1.A | U5.P$3 U5.P$4 12.06,24.9 R39.2
  Top 0.406: C1.1 | 16.95,34.5 D1.C 16.55,36.25 v16.6,36.3 | v5.4,47.9 5.45,47.95 DONE1.A CHRG.A
  Top 0.61: D2.C 22.45,40.65 20.6,38.8 20.6,35.2 19.9,34.5 C1.1 19.59,33.71 U8.3 | C1.1 16.95,34.5 | 16.6,34.05 D1.C
  Bottom 0.254: v10.9,23.5 10.1,23.5
  Bottom 0.279: v13.2,17.4 10.1,20.5 10.1,23.5 10.1,26.7 13.6,30.2 v16.5,30.2
  Bottom 0.406: v5.4,47.9 11.4,47.9 13.5,45.8 15.7,45.8 18,43.5 18,37.7 v16.6,36.3
  pour Top (no thermals): 15.8,27 17,27 17,32.9 17.2,33.2 17.2,34.8 15.8,34.8
VCC  (via drill 0.35, 0.35 pad 0.13)
  Top 0.254: U7.P$5 4.58,2.02 4.84,1.76 C2.1 5.7,1.1 6.2,0.6 9.2,0.6 10.1,1.5 v10.1,7.6 | v13.3,15.5 17.6,19.8 25.15,19.8 25.25,19.7 | 41.5,20.75 C3.1 | 30.92,25.17 U1.4 | R16.2 34.15,35.95 v34.8,36.6
  Top 0.305: U1.18 C12.1 | R6.2 25.25,19.7 R5.2 25.25,21.95 23.2,24 23.2,26.1 23.75,26.65 C12.1 | 41.5,20.75 U3.4 | C3.1 R1.1 41.35,17.45 40.8,16.9 38.67,16.9 36.22,19.35 33.5,19.35 32.9,19.95 32.9,24.1 31.85,25.15 | 31.85,25.15 U1.4 | U1.6 31.25,26.15 31.7,25.7 31.7,25.3 31.85,25.15 | v39,45.6 39,44.7 40.2,43.5 40.2,40.25
  Top 0.406: 24.35,33.34 C6.1 | C12.1 | 40.2,40.25 R13.1 | U8.2
  Top 0.61: U8.2 24.35,33.34 | C6.1 25.5,33.3 26,32.8 26,30.1 24.4,28.5 C12.1 | v24.7,45.6 23.2,45.6 v20.9,43.3 | v21.8,36 U8.2 | U3.4 41.5,26 v41.4,26.1 | v49.9,29.7 50.4,30.2 50.4,34 49.95,34.45 JP1.VCC 49.95,47.05 49.3,47.7 43.64,47.7 42.99,47.05 C15.1 40,47.05 39,46.05 v39,45.6
  Bottom 0.254: v10.1,7.6 10.1,12.3 v13.3,15.5 | v34.8,36.6 34.8,41.4 v39,45.6
  Bottom 0.61: v39,45.6 v24.7,45.6 | v20.9,43.3 20.9,36.9 v21.8,36 | v49.9,29.7 45,29.7 v41.4,26.1
VLIPO  (via drill 0.35 pad 0.13)
  Top 0.508: v19.5,26.4
  Top 0.61: 4.6,24.65 S2.2 | 4.6,24.65 C20.1 6.7,27.3 6.7,32.1 8.7,34.1 D1.A | JP2.2 4.6,24.65
  Top 0.813: v14.1,28.7 14.1,31.7 12.85,32.95 D1.A
  Bottom 0.813: v19.5,26.4 19.5,27.8 18.6,28.7 v14.1,28.7
  pour Top (no thermals): 17.3,27.7 19.3,27.7 19.9,27.1 19.9,26.1 19.6,25.8 18,25.8 18,26.7 17.7,27 17.3,27
VLIPO_SWITCH
  Top 0.61: B2.2 13.39,40.21 13.9,39.7 13.9,37.3 12.9,36.3 9.4,36.3 7.3,34.2 5.2,34.2 4.2,33.2 4.2,28.5 S2.3 3.56,27.65 JP2.1

### Text on the board
Bottom: Designed by / Akram Ali
_tsilk: T/RH/CO2 / data logger | v0.3 | May 2017